# EAGLE design pic_prog_breakout (EAGLE 6.5.0)
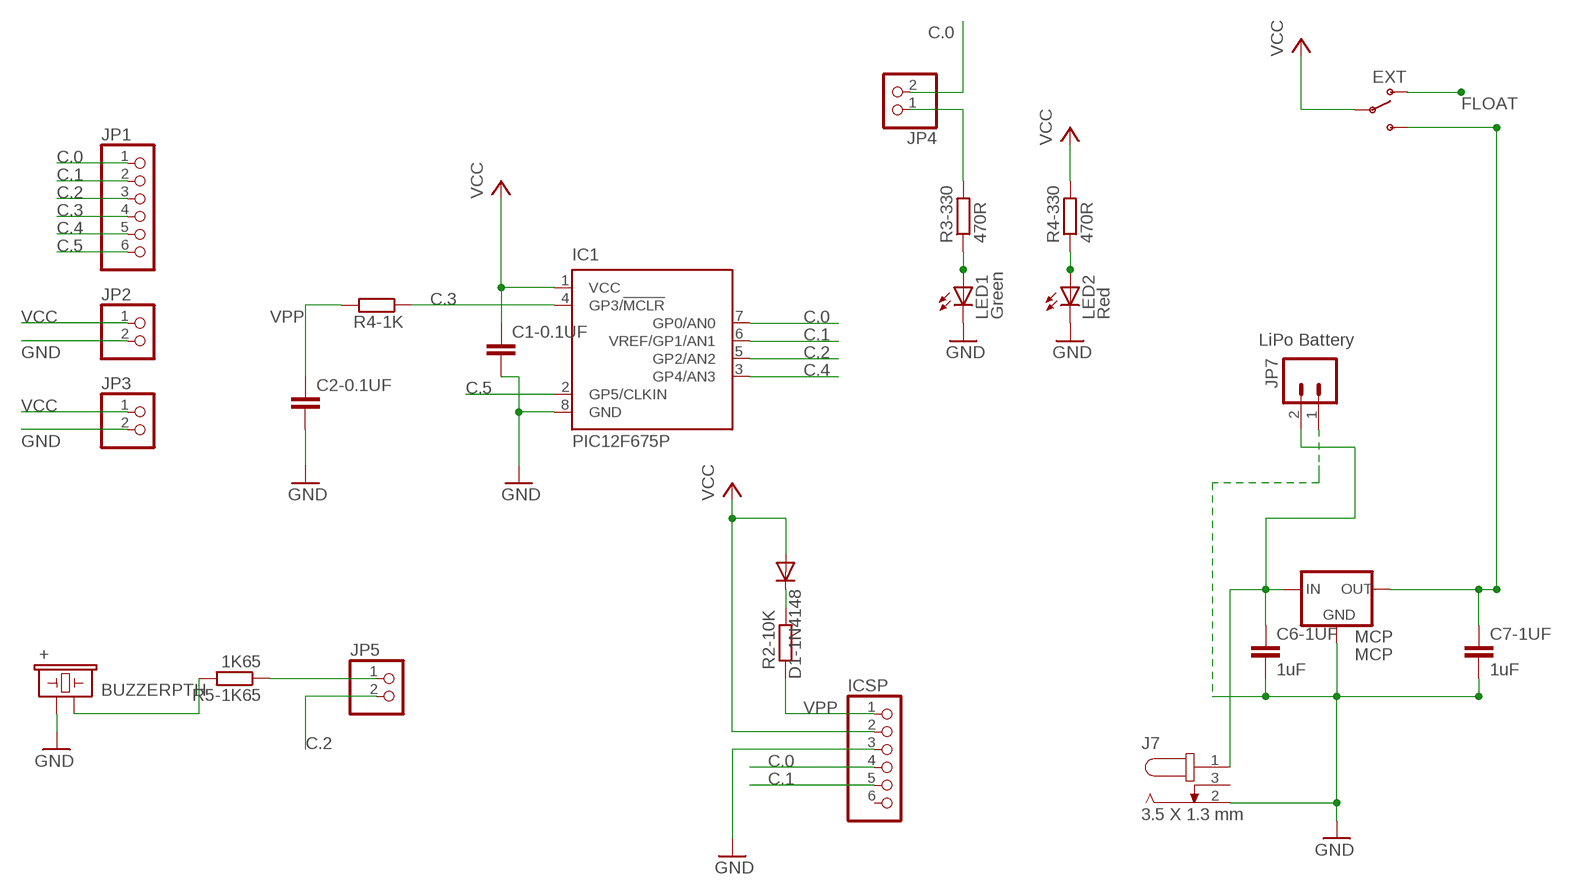
[diagram p0: schematic, sheet 1]

## Parts
+  BUZZERPTH  [BUZZER-12MM]
C1-0.1UF  C-EU025-025X050  [C025-025X050]
C2-0.1UF  C-EU025-025X050  [C025-025X050]
C6-1UF  1uF  C-EU050-025X075  [C050-025X075]
C7-1UF  1uF  C-EU050-025X075  [C050-025X075]
D1-1N4148  1N4148  1N4148DO35-7  [DO35-7]
IC1  PIC12F675P  [DIL8]
ICSP  PINHD-1X6  [1X06]
J7  3.5 X 1.3 mm  DC_JACK_3.5X1.3MM  [3.5X1.3MM_DC_JACK]
JP1  PINHD-1X6  [1X06]
JP2  PINHD-1X2  [1X02]
JP3  PINHD-1X2  [1X02]
JP4  PINHD-1X2  [1X02]
JP5  PINHD-1X2  [1X02]
JP7  LiPo Battery  M02JST-PTH-2  [JST-2-PTH]
LED1  Green  LED3MM  [LED3MM]
LED2  Red  LED3MM  [LED3MM]
MCP  MCP  MCP1700TO-92  [TO92-]
ON  EXT  SWITCH-SPSTPTH  [SWITCH-SPDT]
R2-10K  R-EU_0207/10  [0207/10]
R3-330  470R  R-EU_0207/10  [0207/10]
R4-1K  R-EU_0207/10  [0207/10]
R4-330  470R  R-EU_0207/10  [0207/10]
R5-1K65  1K65  R-EU_0207/10  [0207/10]

## Nets
C.0: IC1.7(GP0/AN0) ICSP.4 JP1.1 JP4.2
C.1: IC1.6(VREF/GP1/AN1) ICSP.5 JP1.2
C.2: IC1.5(GP2/AN2) JP1.3 JP5.2
C.3: IC1.4(GP3/!MCLR) JP1.4 R4-1K.1
C.4: IC1.3(GP4/AN3) JP1.5
C.5: IC1.2(GP5/CLKIN) JP1.6
FLOAT: ON.1(O)
GND [GND]: +.+ C1-0.1UF.2 C2-0.1UF.2 C6-1UF.2 C7-1UF.2 IC1.8(GND) ICSP.3 J7.2 JP2.2 JP3.2 JP7.1 LED1.K(C) LED2.K(C) MCP.3(GND)
N$1: LED2.A R4-330.1
N$2: +.- R5-1K65.2
N$3: JP4.1 R3-330.2
N$4: LED1.A R3-330.1
N$5: D1-1N4148.C R2-10K.2
N$6: JP5.1 R5-1K65.1
VCC [VCC]: C1-0.1UF.1 D1-1N4148.A IC1.1(VCC) ICSP.2 JP2.1 JP3.1 ON.2(P) R4-330.2
VCCEXT [VCC]: C6-1UF.1 J7.1 JP7.2 MCP.2(IN)
VCCREG [VCC]: C7-1UF.1 MCP.1(OUT) ON.3(S)
VPP: C2-0.1UF.1 ICSP.1 R2-10K.1 R4-1K.2
Unconnected: ICSP.6 J7.3

## Library data of the parts
+ = SparkFun:BUZZER: Buzzer 12mm Spark Fun Electronics SKU : Comp-Buzzer
C1-0.1UF C2-0.1UF C6-1UF C7-1UF = resistor:C-EU: CAPACITOR, European symbol
D1-1N4148 = diode:1N4148: DIODE high speed (Philips)
IC1 = microchip:PIC12F675: 8-Pin FLASH-Based 8-Bit CMOS Microcontroller Precision Internal 4 MHz oscillator factory calibrated to ±1% Low Power Features: Standby Current: - 1 nA @ 2.0V, typical Operating Current: - 8.5µA @ 32 kHz, 2.0V, typical - 100µA @ 1 MHz, 2.0V, typical Watchdog Timer Current: - 300 nA @ 2.0V, typical Timer1 oscillator current: - 4µA @ 32 kHz, 2.0V, typical Analog-to-Digital Converter module: - 10-bit resolution - Programmable 4-channel input - Voltage reference input Source: http://www.microchip.com .. 41190E.pdf; MF: MICROCHIP; MPN: PIC12F675-E/P; OC_FARNELL: 9759018; OC_NEWARK: 92C4340
ICSP JP1 = pinhead:PINHD-1X6: PIN HEADER
J7 = MY_CONN:DC_JACK_3.5X1.3MM
JP2-JP5 = pinhead:PINHD-1X2: PIN HEADER
JP7 = SparkFun:M02: Header 2 Standard 2-pin 0.1" header. Use with straight break away headers (SKU : PRT-00116), right angle break away headers (PRT-00553), swiss pins (PRT-00743), machine pins (PRT-00117), and female headers (PRT-00115). Molex polarized connector foot print use with SKU : PRT-08233 with associated crimp pins and housings.
LED1 LED2 = adafruit:LED: LED OSRAM: - CHIPLED LG R971, LG N971, LY N971, LG Q971, LY Q971, LO R971, LY R971 LH N974, LH R974 LS Q976, LO Q976, LY Q976 LO Q996 - Hyper CHIPLED LW Q18S LB Q993, LB Q99A, LB R99A - SideLED LS A670, LO A670, LY A670, LG A670, LP A670 LB A673, LV A673, LT A673, LW A673 LH A674 LY A675 LS A676, LA A676, LO A676, LY A676, LW A676 LS A679, LY A679, LG A679 - Hyper Micro SIDELED® LS Y876, LA Y876, LO Y876, LY Y876 LT Y87S - SmartLED LW L88C, LW L88S LB L89C, LB L89S, LG L890 LS L89K, LO L89K, LY L89K LS L896, LA L896, LO L896, LY L896 - TOPLED LS T670, LO T670, LY T670, LG T670, LP T670 LSG T670, LSP T670, LSY T670, LOP T670, LYG T670 LG T671, LOG T671, LSG T671 LB T673, LV T673, LT T673, LW T673 LH T674 LS T676, LA T676, LO T676, LY T676, LB T676, LH T676, LSB T676, LW T676 LB T67C, LV T67C, LT T67C, LS T67K, LO T67K, LY T67K, LW E67C LS E67B, LA E67B, LO E67B, LY E67B, LB E67C, LV E67C, LT E67C LW T67C LS T679, LY T679, LG T679 LS T770, LO T770, LY T770, LG T770, LP T770 LB T773, LV T773, LT T773, LW T773 LH T774 LS E675, LA E675, LY E675, LS T675 LS T776, LA T776, LO T776, LY T776, LB T776 LHGB T686 LT T68C, LB T68C - Hyper Mini TOPLED® LB M676 - Mini TOPLED Santana® LG M470 LS M47K, LO M47K, LY M47K Source: http://www.osram.convergy.de/
MCP = MY_IC:MCP1700
ON = SparkFun:SWITCH-SPST: SPST Switch Simple slide switch. Spark Fun Electronics SKU : COM-00102
R2-10K R3-330 R4-1K R4-330 R5-1K65 = resistor:R-EU_: RESISTOR, European symbol

## Net classes
0 default: width 0.508 mm
1 GND: width 0.889 mm, drill 0.508 mm, clearance 0.254 mm
2 VCC: width 0.889 mm, drill 0.508 mm, clearance 0.254 mm

## Board
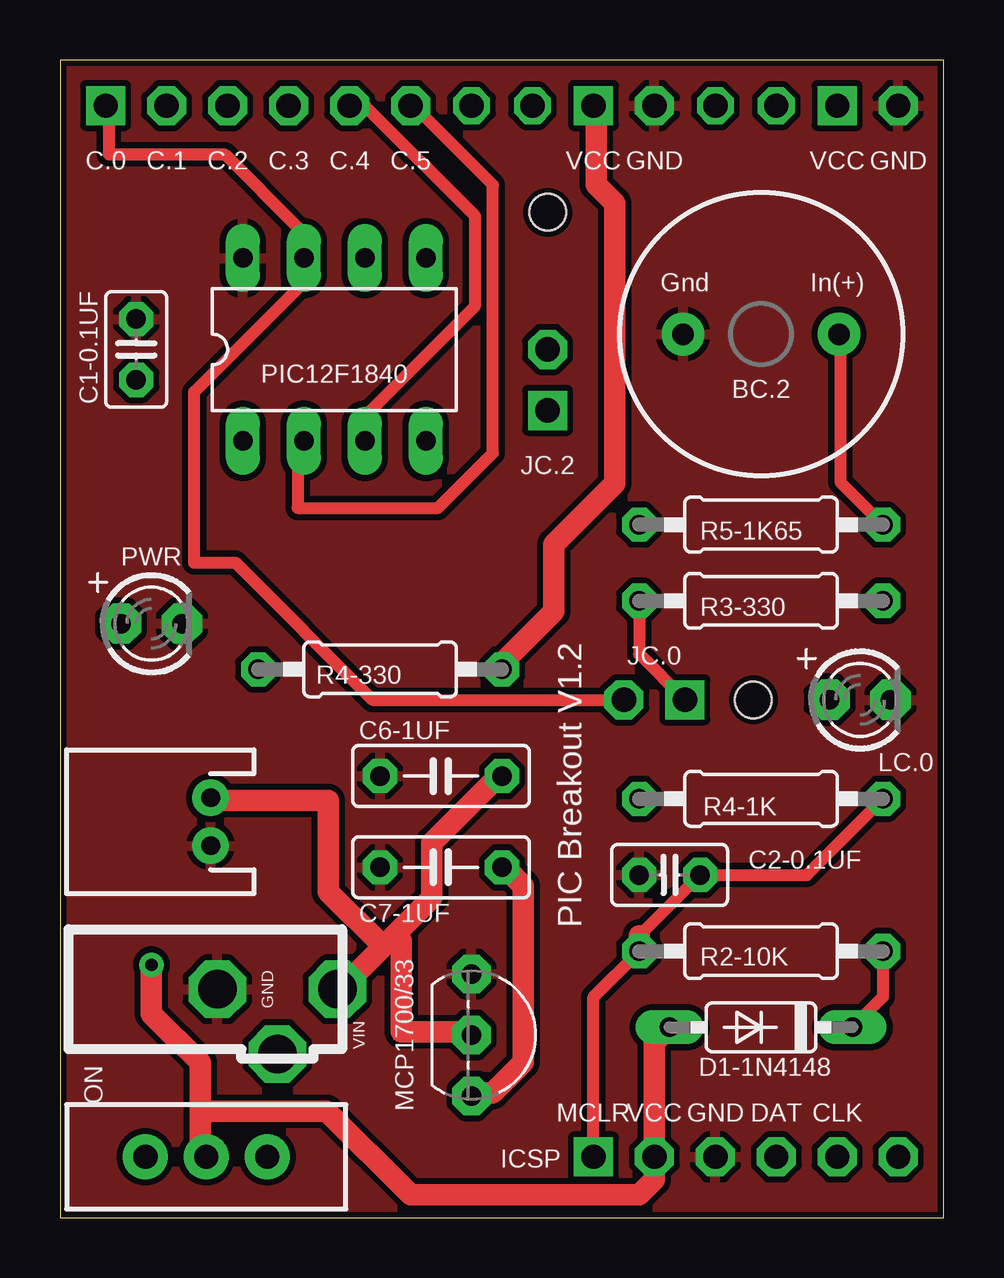
[diagram p1: board, top side]
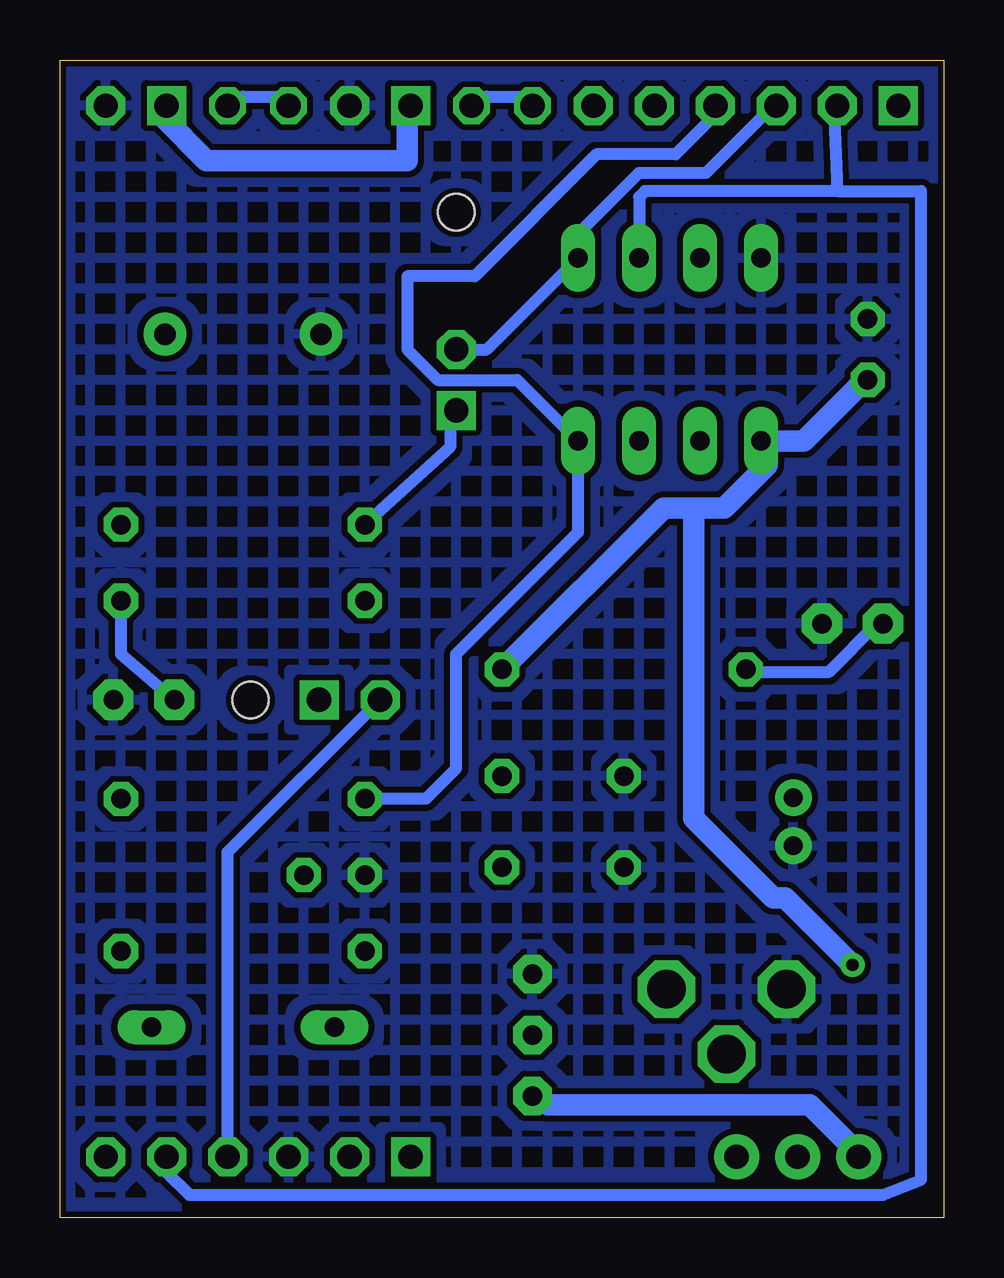
[diagram p2: board, bottom side, seen from below]

Size 36.83 x 48.26 mm. Coordinates in mm from the lower left corner, seen from the top.
Outline: 0,0 36.83,0 36.83,48.26 0,48.26 0,0
Copper layers (1*16): Top 0.035mm / dielectric 1.5mm / Bottom 0.035mm
Design rules "SparkFun *": minimum track width 20mil, minimum drill 20mil, track to track 8mil, track to pad 8mil, pad to pad 8mil, via to via 8mil, smd to smd 8mil, copper to edge 10mil, drill to drill 8mil, minimum pad ring 12mil, minimum via ring 10mil, stop-mask expansion 4mil, vias tented up to drill 25mil, thermal gap 10mil
Holes 1.52 mm at 20.32,41.91 28.89,21.59

### Footprints (pad centres in the part's own frame; a part is rotated, then mirrored left to right if it is on the bottom)
BUZZER-12MM = drill 0.9 pad 1.778: + 3.25,0; - -3.25,0
C025-025X050 = drill 0.813 octagon: 1 -1.27,0; 2 1.27,0
C050-025X075 = drill 0.813 octagon: 1 -2.54,0; 2 2.54,0
DO35-7 = drill 0.813 long: A 3.81,0; C -3.81,0
DIL8 = drill 0.813 long: 1 -3.81,-3.81; 2 -1.27,-3.81; 3 1.27,-3.81; 4 3.81,-3.81; 5 3.81,3.81; 6 1.27,3.81; 7 -1.27,3.81; 8 -3.81,3.81
1X06 = drill 1.016 square: 1 -6.35,0 | drill 1.016 octagon: 2 -3.81,0; 3 -1.27,0; 4 1.27,0; 5 3.81,0; 6 6.35,0
3.5X1.3MM_DC_JACK = drill 1.6 octagon: 1 0,0; 2 -5,0; 3 -2.5,-2.7
1X02 = drill 1.016 square: 1 -1.27,0 | drill 1.016 octagon: 2 1.27,0
JST-2-PTH = drill 0.787 pad 1.524: 1 -1,0; 2 1,0
LED3MM = drill 0.813 pad 1.676 octagon: A -1.27,0; K 1.27,0
TO92- = drill 0.813 pad 1.6 octagon: 1 2.54,0; 2 0,0; 3 -2.54,0
SWITCH-SPDT = drill 1.016 pad 1.88: 1 0,2.54; 2 0,0; 3 0,-2.54
0207/10 = drill 0.813 octagon: 1 -5.08,0; 2 5.08,0

### Placement (x,y rotation side)
+  29.21,36.83 180 top
C1-0.1UF  3.18,36.2 90 top
C2-0.1UF  25.4,14.29 180 top
C6-1UF  15.87,18.41 180 top
C7-1UF  15.87,14.61 180 top
D1-1N4148  29.21,7.94 180 top
IC1  11.43,36.2 0 top
ICSP  28.57,2.54 0 top
J7  11.56,9.53 0 top
JP1  8.25,46.35 0 top
JP2  33.66,46.35 0 top
JP3  23.5,46.35 0 top
JP4  24.77,21.59 180 top
JP5  20.32,34.92 90 top
JP7  6.27,16.51 90 top
LED1  33.34,21.59 0 top
LED2  3.81,24.77 0 top
MCP  17.14,7.62 270 top
ON  6.1,2.54 270 top
R2-10K  29.21,11.11 0 top
R3-330  29.21,25.72 180 top
R4-1K  29.21,17.46 0 top
R4-330  13.33,22.86 0 top
R5-1K65  29.21,28.89 0 top

### Tracks (layer width: path | path; a pad name or v marks a point on that pad's centre or on a via)
C.0
  Top 0.508: 9.91,40.26 9.91,41.27 6.86,44.32 2.03,44.32 2.03,46.35 JP1.1 | 9.91,40.26 9.91,38.73 5.59,34.42 5.59,27.3 7.3,27.3 13.02,21.59 JP4.2 | 9.91,40.26 IC1.7
  Bottom 0.508: ICSP.4 29.85,15.24 JP4.2
C.1
  Bottom 0.508: IC1.6 12.7,42.55 12.45,42.8 4.45,42.8 | 4.45,42.8 4.57,45.85 4.57,46.35 JP1.2 | 4.45,42.8 0.95,42.8 0.95,1.59 2.54,0.95 31.43,0.95 32.38,1.9 ICSP.5
C.2
  Bottom 0.508: JP5.2 19.05,36.2 IC1.5 15.24,41.02 12.7,43.56 9.91,43.56 7.11,46.35 JP1.3
C.3
  Bottom 0.508: JP1.4 9.65,46.35 9.65,45.85 11.18,44.32 14.48,44.32 19.56,39.24 22.35,39.24 22.35,36.2 21.08,34.92 17.78,34.92 IC1.4 15.24,28.58 20.32,23.5 20.32,18.73 21.59,17.46 R4-1K.1
C.4
  Top 0.508: IC1.3 12.95,32.64 12.95,33.66 17.27,37.97 17.27,41.78 12.7,46.35 12.19,46.35 JP1.5
C.5
  Top 0.508: IC1.2 9.91,32.13 9.91,29.59 15.75,29.59 18.03,31.88 18.03,43.05 14.73,46.35 JP1.6
GND
  pour Top: -0.64,48.9 37.46,48.9 37.46,-0.64 -0.64,-0.64
  pour Bottom (hatched): -0.64,48.9 37.46,48.9 37.46,-0.64 -0.64,-0.64
N$1
  Bottom 0.508: LED2.A 2.79,24.77 4.83,22.73 8.13,22.73 R4-330.1
N$2
  Top 0.508: R5-1K65.2 32.51,30.67 32.51,36.7 +.-
N$3
  Top 0.508: R3-330.2 24.13,23.5 JP4.1
N$4
  Bottom 0.508: R3-330.1 34.29,23.5 LED1.A
N$5
  Top 0.508: R2-10K.2 34.29,9.21 D1-1N4148.C
N$6
  Bottom 0.508: R5-1K65.1 20.57,32.13 20.57,33.66 JP5.1
SPARE0  (via drill 1.02)
  Bottom 0.508: v17.14,46.35 17.27,46.48 17.53,46.74 19.05,46.74 19.3,46.48 19.56,46.48 v19.69,46.35
SPARE1  (via drill 1.02)
  Bottom 0.508: v27.3,46.35 27.43,46.48 27.69,46.74 29.21,46.74 29.46,46.48 29.72,46.48 v29.85,46.35
VCC  (via drill 0.51)
  Top 0.889: 5.84,4.13 5.84,6.48 3.81,8.51 v3.81,10.54 | 5.84,4.13 5.84,2.92 6.1,2.67 ON.2 | JP3.1 22.35,46.35 22.35,43.05 23.11,42.29 23.11,30.61 20.57,28.07 20.57,25.27 18.54,23.24 18.54,22.99 R4-330.2 | 5.84,4.13 6.16,4.45 11.11,4.45 14.6,0.95 24.13,0.95 24.77,1.59 ICSP.2 24.77,7.3 D1-1N4148.A
  Bottom 0.889: JP3.1 22.35,46.35 22.35,44.07 30.73,44.07 32.51,45.85 32.51,46.35 JP2.1 | C1-0.1UF.1 3.3,34.92 5.84,32.38 IC1.1 7.37,32.13 7.37,31.37 9.14,29.59 10.41,29.59 | R4-330.2 11.68,29.59 10.41,29.59 | v3.81,10.54 6.6,13.34 7.11,13.34 10.41,16.64 10.41,29.59
VCCEXT
  Top 0.889: 6.1,17.65 JP7.2 6.6,17.4 11.18,17.4 11.18,13.59 13.46,11.3 | 13.46,11.3 11.68,9.53 J7.1 | 13.46,11.3 13.97,11.81 | 13.97,11.81 15.49,13.34 15.49,15.62 18.29,18.41 C6-1UF.1 | MCP.2 17.02,7.75 14.22,7.75 14.22,11.56 13.97,11.81
VCCREG
  Top 0.889: C7-1UF.1 18.54,14.61 19.3,13.84 19.3,6.48 18.03,5.21 17.27,5.21 MCP.1
  Bottom 0.889: ON.3 3.56,2.67 5.59,4.7 16.51,4.7 16.76,4.95 17.02,4.95 MCP.1
VPP
  Top 0.508: ICSP.1 22.23,9.21 R2-10K.1 | 24.13,11.75 C2-0.1UF.1 31.11,14.29 R4-1K.2
  Top 0.889: R2-10K.1 24.13,11.75

### Text on the board
tNames: C.0 | C.1 | C.2 | C.3 | C.4 | C.5 | VCC | GND | VCC | GND | Gnd | In(+) | PIC12F1840 | BC.2 | JC.2 | PWR | JC.0 | LC.0 | PIC Breakout V1.2 | GND | VIN | MCP1700/33 | MCLR | VCC | GND | DAT | CLK